# Altium schematic sheet SubBus12.SchDoc
size A
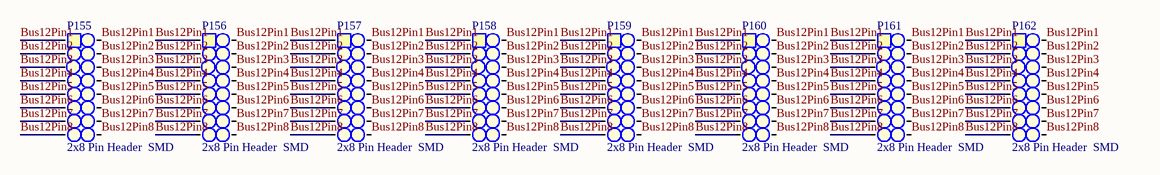
[diagram p0: SubBus12.SchDoc]

## Parts
P155  2x8 Pin Header  SMD  [2X8_SMD_PH_2.54]
P156  2x8 Pin Header  SMD  [2X8_SMD_PH_2.54]
P157  2x8 Pin Header  SMD  [2X8_SMD_PH_2.54]
P158  2x8 Pin Header  SMD  [2X8_SMD_PH_2.54]
P159  2x8 Pin Header  SMD  [2X8_SMD_PH_2.54]
P160  2x8 Pin Header  SMD  [2X8_SMD_PH_2.54]
P161  2x8 Pin Header  SMD  [2X8_SMD_PH_2.54]
P162  2x8 Pin Header  SMD  [2X8_SMD_PH_2.54]

## Nets
Bus12Pin1: P155.1 P155.16 P156.1 P156.16 P157.1 P157.16 P158.1 P158.16 P159.1 P159.16 P160.1 P160.16 P161.1 P161.16 P162.1 P162.16
Bus12Pin2: P155.2 P155.15 P156.2 P156.15 P157.2 P157.15 P158.2 P158.15 P159.2 P159.15 P160.2 P160.15 P161.2 P161.15 P162.2 P162.15
Bus12Pin3: P155.3 P155.14 P156.3 P156.14 P157.3 P157.14 P158.3 P158.14 P159.3 P159.14 P160.3 P160.14 P161.3 P161.14 P162.3 P162.14
Bus12Pin4: P155.4 P155.13 P156.4 P156.13 P157.4 P157.13 P158.4 P158.13 P159.4 P159.13 P160.4 P160.13 P161.4 P161.13 P162.4 P162.13
Bus12Pin5: P155.5 P155.12 P156.5 P156.12 P157.5 P157.12 P158.5 P158.12 P159.5 P159.12 P160.5 P160.12 P161.5 P161.12 P162.5 P162.12
Bus12Pin6: P155.6 P155.11 P156.6 P156.11 P157.6 P157.11 P158.6 P158.11 P159.6 P159.11 P160.6 P160.11 P161.6 P161.11 P162.6 P162.11
Bus12Pin7: P155.7 P155.10 P156.7 P156.10 P157.7 P157.10 P158.7 P158.10 P159.7 P159.10 P160.7 P160.10 P161.7 P161.10 P162.7 P162.10
Bus12Pin8: P155.8 P155.9 P156.8 P156.9 P157.8 P157.9 P158.8 P158.9 P159.8 P159.9 P160.8 P160.9 P161.8 P161.9 P162.8 P162.9

## Library data of the parts
P155-P162 = 2x8 Pin Header  SMD: 2.54mm, SMD; Value: 2x8 Pin Header, 2.54mm, SMD; Farnell: 2356242